# Altium project mod_duo_x.PrjPCB (part 2 of 3)

## Sheet [3]-ROTARY_ENCODER.SchDoc
size A3; SheetNumber: 4; SheetTotal: 8
Used 2 times, as channels U_[3]-ROTARY_ENCODER1, U_[3]-ROTARY_ENCODER2. Parts and nets are listed once, with the designators drawn on the sheet.
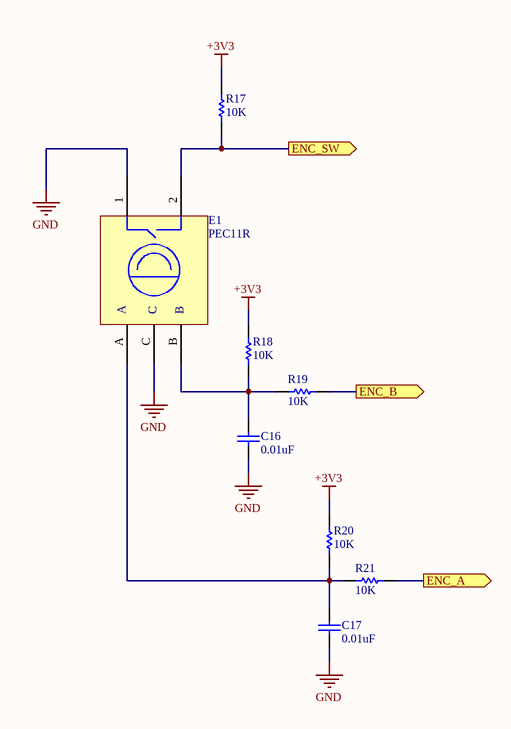
[diagram p3: [3]-ROTARY_ENCODER.SchDoc]

### Parts
C16  0.01uF  [CAPC1608N]
C17  0.01uF  [CAPC1608N]
E1  PEC11R  [PEC11R]
R17  10K  [RESC1608N]
R18  10K  [RESC1608N]
R19  10K  [RESC1608N]
R20  10K  [RESC1608N]
R21  10K  [RESC1608N]

### Ports
ENC_A (out), ENC_B (out), ENC_SW (out)

### Nets
+3V3: R17.2 R18.2 R20.2
GND: C16.1 C17.1 E1.1 E1.C
ENC_A: R21.1 ; port ENC_A
ENC_B: R19.1 ; port ENC_B
ENC_SW: E1.2 R17.1 ; port ENC_SW
NetC16_2: C16.2 E1.B R18.1 R19.2
NetC17_2: C17.2 E1.A R20.1 R21.2

### Channels
U_[3]-ROTARY_ENCODER1: designators end in A; ports ENC_A=ENC_A1 ENC_B=ENC_B1 ENC_SW=ENC_SW1
U_[3]-ROTARY_ENCODER2: designators end in B; ports ENC_A=ENC_A2 ENC_B=ENC_B2 ENC_SW=ENC_SW2

### Library data of the parts
C16 C17 = 06035C-103KAT2A: CAP CER 10000PF 50V X7R 0603; Manufacturer 1: Kyocera AVX; Dielectric Material: Ceramic; Tolerance: 10%; Capacitance: 10nF; Dissipation Factor: 2.5%; Insulation Resistance: 100GR; Supplier 1: Digi-Key; Manufacturer Part Number 1: 06035C-103KAT2A; Stock 1: 40000; Pricing 1: 1=0.1, 10=0.075, 100=0.0334, 500=0.02388, 1000=0.01877 (USD); Mount: Surface Mount,PCB; Case/Package: 0603; Number of Pins: 2; Case Code (Metric): 1608; Case Code (Imperial): 0603; Contact Plating: Tin,Matte; Min Operating Temperature: -55°C; Max Operating Temperature: 125°C; Dielectric: X7R; Voltage Rating (DC): 50V; Packaging: Tape and Reel; Voltage: 50V; Voltage Rating: 50V; Package Quantity: 1; Termination: SMD/SMT; Length: 1.6mm; Height: 0.9mm; Width: 0.032inch; Depth: 0.81mm; Thickness: 0.035inch; Radiation Hardening: No; REACH SVHC: No SVHC; Lead Free: Lead Free; ComponentLink1URL: https://datasheet.ciiva.com/1124/1679506-1124848.pdf; ComponentLink1Description: https://datasheet.ciiva.com/1124/1679506-1124848.pdf; ComponentLink2URL: https://datasheet.ciiva.com/2987/cx7r-2987824.pdf; ComponentLink2Description: https://datasheet.ciiva.com/2987/cx7r-2987824.pdf; ComponentLink3URL: https://datasheet.ciiva.com/150/cx7r-150227.pdf; ComponentLink3Description: https://datasheet.ciiva.com/150/cx7r-150227.pdf; ComponentLink4URL: https://datasheet.ciiva.com/150/cx7r-150228.pdf; ComponentLink4Description: https://datasheet.ciiva.com/150/cx7r-150228.pdf; ComponentLink5URL: https://datasheet.ciiva.com/150/cx7r-150229.pdf; ComponentLink5Description: https://datasheet.ciiva.com/150/cx7r-150229.pdf; ComponentLink6URL: https://datasheet.ciiva.com/16209/cx7r-16209238.pdf; ComponentLink6Description: https://datasheet.ciiva.com/16209/cx7r-16209238.pdf; ComponentLink7URL: https://datasheet.ciiva.com/15212/getdatasheetpartid-87506-15212295.pdf; ComponentLink7Description: https://datasheet.ciiva.com/15212/getdatasheetpartid-87506-15212295.pdf; ComponentLink8URL: https://datasheet.ciiva.com/5423/cx7r-218113-5423178.pdf; ComponentLink8Description: https://datasheet.ciiva.com/5423/cx7r-218113-5423178.pdf; ComponentLink9URL: https://datasheet.ciiva.com/7855/1679506-7855082.pdf; ComponentLink9Description: https://datasheet.ciiva.com/7855/1679506-7855082.pdf; ComponentLink10URL: https://datasheet.ciiva.com/14585/70001075-14585146.pdf; ComponentLink10Description: https://datasheet.ciiva.com/14585/70001075-14585146.pdf; ComponentLink11URL: https://datasheet.ciiva.com/25901/cx7r-25901100.pdf; ComponentLink11Description: https://datasheet.ciiva.com/25901/cx7r-25901100.pdf; ComponentLink12URL: https://datasheet.ciiva.com/1124/1679506-1124847.pdf; ComponentLink12Description: https://datasheet.ciiva.com/1124/1679506-1124847.pdf; ComponentLink13URL: https://datasheet.ciiva.com/2987/cx7r-2987823.pdf; ComponentLink13Description: https://datasheet.ciiva.com/2987/cx7r-2987823.pdf; Supplier Part Number 1: 478-1227-1-ND
E1 = PEC11R-4215F-S0024: ENCODER ROTARY 15MM SHAFT; Manufacturer 1: Bourns; Number of Channels: 2; Encoder Type: Mechanical; Pulses per Revolution: 24; Detent: Yes; Output Type: Quadrature,Incremental; Hole Diameter: 1.8mm; Supplier 1: Digi-Key; Manufacturer Part Number 1: PEC11R-4215F-S0024; Stock 1: 2746; Pricing 1: 1=1.68, 10=1.566, 25=1.4792, 50=1.305, 150=1.073, 300=1.044, 600=0.986, 1050=0.928, 5100=0.812 (USD); Mount: Through Hole,Panel,PCB; Min Operating Temperature: -30°C; Max Operating Temperature: 70°C; Package Quantity: 150; Packaging: Bulk; Termination: PC Pins; Orientation: Vertical; Built in Switch: Yes; Type: Mechanical; Length: 21.5mm; Height: 13.4mm; Width: 12.5mm; Radiation Hardening: No; REACH SVHC: No SVHC; ComponentLink1URL: https://datasheet.ciiva.com/26917/getdatasheetpartid-730131-26917851.pdf; ComponentLink1Description: https://datasheet.ciiva.com/26917/getdatasheetpartid-730131-26917851.pdf; ComponentLink2URL: https://datasheet.ciiva.com/12175/pec11r-221203-12175422.pdf; ComponentLink2Description: https://datasheet.ciiva.com/12175/pec11r-221203-12175422.pdf; Supplier Part Number 1: PEC11R-4215F-S0024-ND
R17-R21 = AC0603JR-0710KL: RES SMD 10K OHM 5% 1/10W 0603; Manufacturer 1: Yageo; Voltage Rating: 50V; Resistance: 10kR; Power Rating: 100mW; Temperature Coefficient: 100ppm/°C; Supplier 1: Digi-Key; Manufacturer Part Number 1: AC0603JR-0710KL; Stock 1: 60451; Pricing 1: 1=0.1, 10=0.032, 100=0.0131, 1000=0.00588, 2500=0.0051 (USD); Case/Package: 0603; Case Code (Imperial): 0603; Case Code (Metric): 1608; Min Operating Temperature: -55°C; Max Operating Temperature: 155°C; Packaging: Tape and Reel; Tolerance: 5%; Package Quantity: 1; Composition: Thick Film; Termination: SMD/SMT; Number of Terminations: 2; Military Standard: Not; Max Power Dissipation: 100mW; Features: Moisture Resistant,Automotive AEC-Q200,Anti-Sulfur; Length: 0.063inch; Height: 0.022inch; Width: 0.031inch; Depth: 0.8mm; Lead Free: Lead Free; ComponentLink1URL: https://datasheet.ciiva.com/5562/pyu-ac-51-rohs-l-2-5562553.pdf; ComponentLink1Description: https://datasheet.ciiva.com/5562/pyu-ac-51-rohs-l-2-5562553.pdf; Supplier Part Number 1: 311-10KLECT-ND

## Sheet [4]-DISPLAY_ERC12864FS.SchDoc
size A3; SheetNumber: 5; SheetTotal: 8
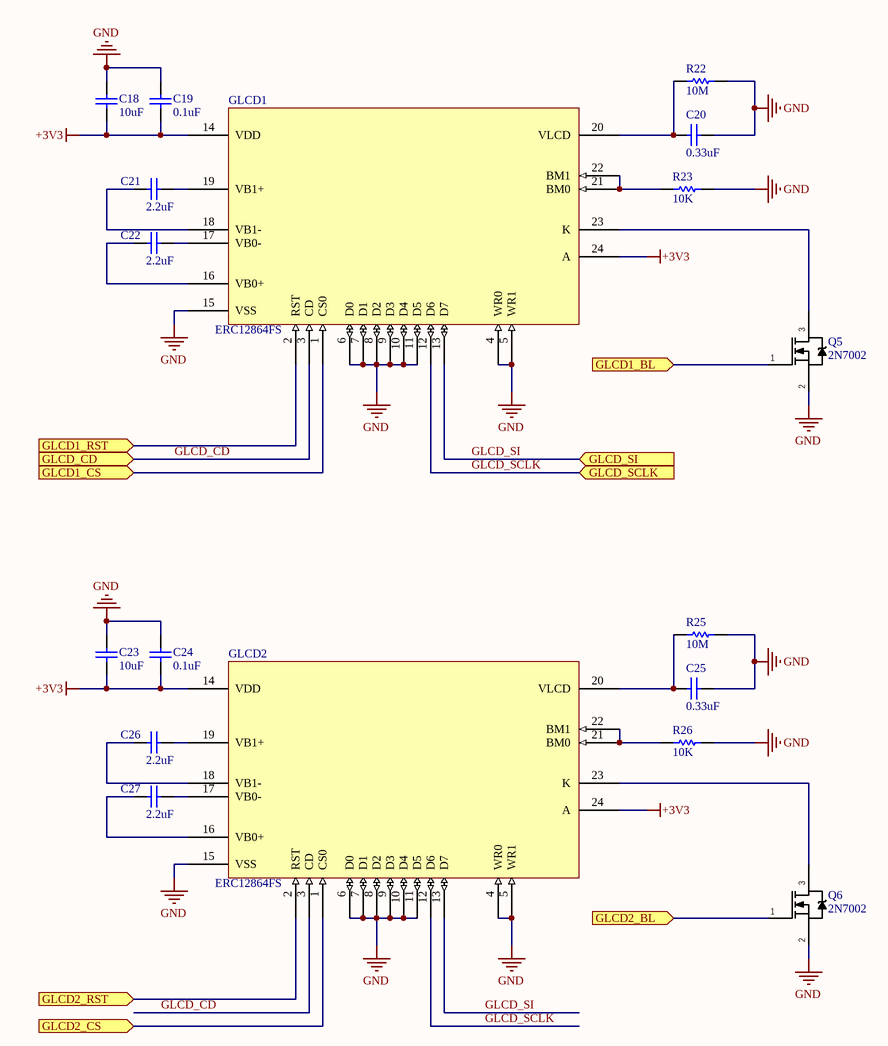
[diagram p4: [4]-DISPLAY_ERC12864FS.SchDoc]

### Parts
C18  10uF  [CAPC1608N]
C19  0.1uF  [CAPC1608N]
C20  0.33uF  [CAPC2012N]
C21  2.2uF  [CAPC2012N]
C22  2.2uF  [CAPC2012N]
C23  10uF  [CAPC1608N]
C24  0.1uF  [CAPC1608N]
C25  0.33uF  [CAPC2012N]
C26  2.2uF  [CAPC2012N]
C27  2.2uF  [CAPC2012N]
GLCD1  ERC12864FS  [ERC12864FS]
GLCD2  ERC12864FS  [ERC12864FS]
Q5  2N7002  [SOT23-3N]
Q6  2N7002  [SOT23-3N]
R22  10M  [RESC1608N]
R23  10K  [RESC1608N]
R25  10M  [RESC1608N]
R26  10K  [RESC1608N]

### Ports
GLCD1_BL (in), GLCD1_CS (in), GLCD1_RST (in), GLCD2_BL (in), GLCD2_CS (in), GLCD2_RST (in), GLCD_CD (in), GLCD_SCLK (in), GLCD_SI (in)

### Nets
+3V3: C18.1 C19.1 C23.1 C24.1 GLCD1.14(VDD) GLCD1.24(A) GLCD2.14(VDD) GLCD2.24(A)
GND: C18.2 C19.2 C20.2 C23.2 C24.2 C25.2 GLCD1.4(WR0) GLCD1.5(WR1) GLCD1.6(D0) GLCD1.7(D1) GLCD1.8(D2) GLCD1.9(D3) GLCD1.10(D4) GLCD1.11(D5) GLCD1.15(VSS) GLCD2.4(WR0) GLCD2.5(WR1) GLCD2.6(D0) GLCD2.7(D1) GLCD2.8(D2) GLCD2.9(D3) GLCD2.10(D4) GLCD2.11(D5) GLCD2.15(VSS) Q5.2(S) Q6.2(S) R22.2 R23.1 R25.2 R26.1
GLCD_CD: GLCD1.3(CD) GLCD2.3(CD) ; port GLCD_CD
GLCD_SCLK: GLCD1.12(D6) GLCD2.12(D6) ; port GLCD_SCLK
GLCD_SI: GLCD1.13(D7) GLCD2.13(D7) ; port GLCD_SI
NetC20_1: C20.1 GLCD1.20(VLCD) R22.1
NetC21_1: C21.1 GLCD1.18(VB1-)
NetC21_2: C21.2 GLCD1.19(VB1+)
NetC22_1: C22.1 GLCD1.16(VB0+)
NetC22_2: C22.2 GLCD1.17(VB0-)
NetC25_1: C25.1 GLCD2.20(VLCD) R25.1
NetC26_1: C26.1 GLCD2.18(VB1-)
NetC26_2: C26.2 GLCD2.19(VB1+)
NetC27_1: C27.1 GLCD2.16(VB0+)
NetC27_2: C27.2 GLCD2.17(VB0-)
NetGLCD1_1: GLCD1.1(CS0) ; port GLCD1_CS
NetGLCD1_2: GLCD1.2(RST) ; port GLCD1_RST
NetGLCD1_21: GLCD1.21(BM0) GLCD1.22(BM1) R23.2
NetGLCD1_23: GLCD1.23(K) Q5.3(D)
NetGLCD2_1: GLCD2.1(CS0) ; port GLCD2_CS
NetGLCD2_2: GLCD2.2(RST) ; port GLCD2_RST
NetGLCD2_21: GLCD2.21(BM0) GLCD2.22(BM1) R26.2
NetGLCD2_23: GLCD2.23(K) Q6.3(D)
NetQ5_1: Q5.1(G) ; port GLCD1_BL
NetQ6_1: Q6.1(G) ; port GLCD2_BL

### Library data of the parts
C18 C23 = GRM188R61A106KE69D: CAP CER 10UF 10V X5R 0603; Manufacturer 1: Murata; Tolerance: 10%; Supplier 1: Digi-Key; Manufacturer Part Number 1: GRM188R61A106KE69D; Stock 1: 40000; Pricing 1: 1=0.22, 10=0.149, 100=0.0754, 500=0.05158, 1000=0.04563 (USD); Mount: Surface Mount; Case/Package: 0603; Case Code (Metric): 1608; Case Code (Imperial): 0603; Min Operating Temperature: -55°C; Max Operating Temperature: 85°C; Capacitance: 10uF; Packaging: Tape and Reel; Dielectric: X5R; Voltage Rating: 10V; Voltage: 10V; Voltage Rating (DC): 10V; Length: 1.6mm; Height: 0.8mm; Width: 0.031inch; Thickness: 0.037inch; Depth: 0.8mm; REACH SVHC: No SVHC; Lead Free: Lead Free; Supplier Part Number 1: 490-10474-1-ND
C19 C24 = CC0603KRX7R8BB104: CAP CER 0.1UF 25V X7R 0603; Manufacturer 1: Yageo; Capacitance: 100nF; Tolerance: 10%; Supplier 1: Digi-Key; Manufacturer Part Number 1: CC0603KRX7R8BB104; Stock 1: 40000; Pricing 1: 1=0.1, 10=0.074, 100=0.0329, 500=0.02352, 1000=0.01848 (USD); Mount: Surface Mount; Case/Package: 0603; Number of Pins: 2; Case Code (Imperial): 0603; Case Code (Metric): 1608; Min Operating Temperature: -55°C; Max Operating Temperature: 125°C; Dielectric: X7R; Voltage Rating: 25V; Packaging: Tape and Reel; Package Quantity: 1; Voltage Rating (DC): 25V; Termination: SMD/SMT; Composition: Ceramic; Voltage: 25V; Length: 1.6mm; Height: 0.8mm; Width: 0.8mm; Thickness: 0.035inch; Depth: 0.8mm; Radiation Hardening: No; REACH SVHC: Unknown; Lead Free: Lead Free; Halogen Free: Halogen Free; ComponentLink1URL: https://datasheet.ciiva.com/11786/0900766b80c10176-11786120.pdf; ComponentLink1Description: https://datasheet.ciiva.com/11786/0900766b80c10176-11786120.pdf; ComponentLink2URL: https://datasheet.ciiva.com/144/mlccorderingcode-144075.pdf; ComponentLink2Description: https://datasheet.ciiva.com/144/mlccorderingcode-144075.pdf; ComponentLink3URL: https://datasheet.ciiva.com/17434/upy-gphc-x7r-6-3v-to-50v-8-17434263.pdf; ComponentLink3Description: https://datasheet.ciiva.com/17434/upy-gphc-x7r-6-3v-to-50v-8-17434263.pdf; ComponentLink4URL: https://datasheet.ciiva.com/26829/getdatasheetpartid-403577-26829431.pdf; ComponentLink4Description: https://datasheet.ciiva.com/26829/getdatasheetpartid-403577-26829431.pdf; ComponentLink5URL: https://datasheet.ciiva.com/11587/upy-gphc-x7r-6-3v-to-50v-8-11587208.pdf; ComponentLink5Description: https://datasheet.ciiva.com/11587/upy-gphc-x7r-6-3v-to-50v-8-11587208.pdf; ComponentLink6URL: https://datasheet.ciiva.com/13389/upy-gphc-x7r-6-3v-to-50v-8-13389352.pdf; ComponentLink6Description: https://datasheet.ciiva.com/13389/upy-gphc-x7r-6-3v-to-50v-8-13389352.pdf; ComponentLink7URL: https://datasheet.ciiva.com/28450/1489800-28450584.pdf; ComponentLink7Description: https://datasheet.ciiva.com/28450/1489800-28450584.pdf; ComponentLink8URL: https://datasheet.ciiva.com/144/mlccorderingcode-144073.pdf; ComponentLink8Description: https://datasheet.ciiva.com/144/mlccorderingcode-144073.pdf; ComponentLink9URL: https://datasheet.ciiva.com/144/mlccorderingcode-144074.pdf; ComponentLink9Description: https://datasheet.ciiva.com/144/mlccorderingcode-144074.pdf; ComponentLink10URL: https://datasheet.ciiva.com/7978/1489800-7978155.pdf; ComponentLink10Description: https://datasheet.ciiva.com/7978/1489800-7978155.pdf; Supplier Part Number 1: 311-1341-1-ND
C20 C25 = C0805C334K5RACAUTO: CAP CER 0.33UF 50V X7R 0805; Manufacturer 1: Kemet; Description 1: Multilayer Ceramic Capacitors MLCC - SMD/SMT 0.33uF 50volts 10% X7R; Capacitance - nF: 330 nF; Capacitance - pF: 330000 pF; Case Height: 0.9 mm; Case Length: 2 mm; Case Width: 1.2 mm; Class: Class 1; Tolerance: 10 %; Temperature Coefficient / Code: +/- 15 %; Type: SMD MLCC X7R 6.3 - 250 VDC Commerical Grade; Supplier 1: Digi-Key; Manufacturer Part Number 1: C0805C334K5RACAUTO; Stock 1: 76; Pricing 1: 1=0.21, 10=0.142, 100=0.0721, 500=0.0493, 1000=0.0436 (USD); Brand: Kemet; Capacitance: 0.33 uF; Case Code - in: 0805; Case Code - mm: 2012; Dimensions: 1.2 mm W x 2 mm L x 0.9 mm H; Dielectric: X7R; Factory Pack Quantity: 4000; Voltage Rating: 50 V; Product Category: Multilayer Ceramic Capacitors MLCC - SMD/SMT; RoHS: Details; Voltage Rating DC: 50 V; Minimum Operating Temperature: - 55 C; Maximum Operating Temperature: + 125 C; Product: Automotive MLCCs; Operating Temperature Range: - 55 C to + 125 C; Package / Case: 0805 (2012 metric); Packaging: Reel; Series: C0805C; Termination Style: SMD/SMT; ComponentLink1URL: https://datasheet.ciiva.com/7842/1776105-7842326.pdf; ComponentLink1Description: https://datasheet.ciiva.com/7842/1776105-7842326.pdf; ComponentLink2URL: https://datasheet.ciiva.com/22705/1776105-22705463.pdf; ComponentLink2Description: https://datasheet.ciiva.com/22705/1776105-22705463.pdf; Supplier Part Number 1: 399-6959-1-ND; Supplier 2: Digi-Key; Supplier Part Number 2: 1276-1808-1-ND; Manufacturer 2: Samsung; Manufacturer Part Number 2: CL21B334KAFNNNE
C21 C22 C26 C27 = C2012X7R1C225K125AB: CAP CER 2.2UF 16V X7R 0805; Manufacturer 1: TDK; Dielectric Material: Ceramic; Tolerance: 10%; Supplier 1: Digi-Key; Manufacturer Part Number 1: C2012X7R1C225K125AB; Stock 1: 20000; Pricing 1: 1=0.28, 10=0.194, 100=0.0983, 500=0.06728, 1000=0.05951 (USD); Mount: Surface Mount; Case/Package: 0805; Number of Pins: 2; Weight: 0.000194oz; Case Code (Imperial): 0805; Case Code (Metric): 2012; Min Operating Temperature: -55°C; Max Operating Temperature: 125°C; Capacitance: 2.2uF; Dielectric: X7R; Packaging: Tape and Reel; Package Quantity: 2000; Voltage Rating: 16V; Voltage Rating (DC): 16V; Termination: SMD/SMT; Voltage: 16V; Composition: Ceramic; Length: 2mm; Height: 1.25mm; Width: 1.25mm; Depth: 1.25mm; Thickness: 0.057inch; Radiation Hardening: No; REACH SVHC: No SVHC; Lead Free: Lead Free; ComponentLink1URL: https://datasheet.ciiva.com/24219/c2012x7r1c225k125ab-265065-24219730.pdf; ComponentLink1Description: https://datasheet.ciiva.com/24219/c2012x7r1c225k125ab-265065-24219730.pdf; ComponentLink2URL: https://datasheet.ciiva.com/11788/0900766b80c1bb00-11788135.pdf; ComponentLink2Description: https://datasheet.ciiva.com/11788/0900766b80c1bb00-11788135.pdf; ComponentLink3URL: https://datasheet.ciiva.com/26834/getdatasheetpartid-736487-26834421.pdf; ComponentLink3Description: https://datasheet.ciiva.com/26834/getdatasheetpartid-736487-26834421.pdf; ComponentLink4URL: https://datasheet.ciiva.com/16482/e412-c-16482422.pdf; ComponentLink4Description: https://datasheet.ciiva.com/16482/e412-c-16482422.pdf; ComponentLink5URL: https://datasheet.ciiva.com/6291/tdkmlcccaprange-6291383.pdf; ComponentLink5Description: https://datasheet.ciiva.com/6291/tdkmlcccaprange-6291383.pdf; ComponentLink6URL: https://datasheet.ciiva.com/6291/tdkmlcccaprange-6291384.pdf; ComponentLink6Description: https://datasheet.ciiva.com/6291/tdkmlcccaprange-6291384.pdf; ComponentLink7URL: https://datasheet.ciiva.com/22648/1796654-22648712.pdf; ComponentLink7Description: https://datasheet.ciiva.com/22648/1796654-22648712.pdf; ComponentLink8URL: https://datasheet.ciiva.com/6291/tdkmlcccaprange-6291450.pdf; ComponentLink8Description: https://datasheet.ciiva.com/6291/tdkmlcccaprange-6291450.pdf; ComponentLink9URL: https://datasheet.ciiva.com/22694/1796654-22694143.pdf; ComponentLink9Description: https://datasheet.ciiva.com/22694/1796654-22694143.pdf; Supplier Part Number 1: 445-1420-1-ND
GLCD1 GLCD2 = ERC12864FS-655: SERIAL SPI 2.8"GLCD 128x64 UC1701 CONTROLLER; Manufacturer 1: EastRising; Manufacturer Part Number 1: ERC12864FS-655; Supplier 1: EastRising; Supplier Part Number 1: ERC12864FS-655
Q5 Q6 = 2N7002: MOSFET N-CH 60V 115MA SOT-23; Manufacturer 1: ON Semiconductor / Fairchild; Max Power Dissipation: 200mW; Drain to Source Resistance: 1.2R; Gate to Source Voltage (Vgs): 20V; Nominal Vgs: 2.1V; Number of Elements: 1; Element Configuration: Single; Input Capacitance: 50pF; Rds On Max: 7.5R; On-State Resistance: 5.3R; Supplier 1: Digi-Key; Manufacturer Part Number 1: 2N7002; Stock 1: 111118; Pricing 1: 1=0.33, 10=0.304, 100=0.17, 500=0.09108, 1000=0.06193 (USD); Mount: Surface Mount; Case/Package: SOT-23; Number of Pins: 3; Contact Plating: Tin,Matte; Min Operating Temperature: -55°C; Max Operating Temperature: 150°C; Continuous Drain Current (ID): 115mA; Packaging: Tape and Reel; Package Quantity: 1; Drain to Source Voltage (Vdss): 60V; Drain to Source Breakdown Voltage: 60V; Power Dissipation: 200mW; Threshold Voltage: 2.1V; Voltage Rating (DC): 60V; Current Rating: 115mA; Dual Supply Voltage: 60V; Current: 115mA; Voltage: 60V; Length: 2.92mm; Height: 0.93mm; Width: 3.05mm; Radiation Hardening: No; REACH SVHC: No SVHC; Lead Free: Lead Free; ComponentLink1URL: https://datasheet.ciiva.com/931/2n7000-931777.pdf; ComponentLink1Description: https://datasheet.ciiva.com/931/2n7000-931777.pdf; ComponentLink2URL: https://datasheet.ciiva.com/27746/47-0120-27746881.pdf; ComponentLink2Description: https://datasheet.ciiva.com/27746/47-0120-27746881.pdf; ComponentLink3URL: https://datasheet.ciiva.com/1254/2n7002-1254451.pdf; ComponentLink3Description: https://datasheet.ciiva.com/1254/2n7002-1254451.pdf; ComponentLink4URL: https://datasheet.ciiva.com/15137/getdatasheetpartid-93547-15137771.pdf; ComponentLink4Description: https://datasheet.ciiva.com/15137/getdatasheetpartid-93547-15137771.pdf; ComponentLink5URL: https://datasheet.ciiva.com/931/2n7000-931762.pdf; ComponentLink5Description: https://datasheet.ciiva.com/931/2n7000-931762.pdf; ComponentLink6URL: https://datasheet.ciiva.com/931/2n7000-931763.pdf; ComponentLink6Description: https://datasheet.ciiva.com/931/2n7000-931763.pdf; ComponentLink7URL: https://datasheet.ciiva.com/931/2n7000-931764.pdf; ComponentLink7Description: https://datasheet.ciiva.com/931/2n7000-931764.pdf; ComponentLink8URL: https://datasheet.ciiva.com/1254/660093-1254452.pdf; ComponentLink8Description: https://datasheet.ciiva.com/1254/660093-1254452.pdf; ComponentLink9URL: https://datasheet.ciiva.com/1188/660093-1188359.pdf; ComponentLink9Description: https://datasheet.ciiva.com/1188/660093-1188359.pdf; ComponentLink10URL: https://datasheet.ciiva.com/1188/660093-1188361.pdf; ComponentLink10Description: https://datasheet.ciiva.com/1188/660093-1188361.pdf; ComponentLink11URL: https://datasheet.ciiva.com/17007/2n7002-17007243.pdf; ComponentLink11Description: https://datasheet.ciiva.com/17007/2n7002-17007243.pdf; ComponentLink12URL: https://datasheet.ciiva.com/3304/nds7002a-3304380.pdf; ComponentLink12Description: https://datasheet.ciiva.com/3304/nds7002a-3304380.pdf; ComponentLink13URL: https://datasheet.ciiva.com/3304/nds7002a-3304381.pdf; ComponentLink13Description: https://datasheet.ciiva.com/3304/nds7002a-3304381.pdf; ComponentLink14URL: https://datasheet.ciiva.com/22655/660093-22655230.pdf; ComponentLink14Description: https://datasheet.ciiva.com/22655/660093-22655230.pdf; Supplier Part Number 1: 2N7002NCT-ND
R22 R25 = CR0603-JW-106ELF: RES SMD 10M OHM 5% 1/10W 0603; Manufacturer 1: Bourns; Resistance: 10MR; Temperature Coefficient: 200ppm/°C; Power Rating: 100mW; Voltage Rating: 50V; Supplier 1: Digi-Key; Manufacturer Part Number 2: CR0603-JW-106ELF; Stock 1: 29967; Pricing 1: 1=0.1, 10=0.016, 100=0.0064, 1000=0.00289, 2500=0.0025 (USD); Mount: Surface Mount; Case/Package: 0603; Contact Plating: Tin; Case Code (Imperial): 0603; Case Code (Metric): 1608; Min Operating Temperature: -55°C; Max Operating Temperature: 155°C; Tolerance: 5%; Composition: Thick Film; Packaging: Tape and Reel; Package Quantity: 5000; Termination: SMD/SMT; Number of Terminations: 2; Max Power Dissipation: 100mW; Military Standard: Not; Length: 1.6mm; Height: 0.022inch; Width: 0.8mm; Thickness: 457um; Depth: 0.8mm; Radiation Hardening: No; ComponentLink1URL: https://datasheet.ciiva.com/9122/chpreztr-9122300.pdf; ComponentLink1Description: https://datasheet.ciiva.com/9122/chpreztr-9122300.pdf; ComponentLink2URL: https://datasheet.ciiva.com/18605/chpreztr-18605117.pdf; ComponentLink2Description: https://datasheet.ciiva.com/18605/chpreztr-18605117.pdf; ComponentLink3URL: https://datasheet.ciiva.com/18605/chpreztr-18605118.pdf; ComponentLink3Description: https://datasheet.ciiva.com/18605/chpreztr-18605118.pdf; ComponentLink4URL: https://datasheet.ciiva.com/18605/chpreztr-18605119.pdf; ComponentLink4Description: https://datasheet.ciiva.com/18605/chpreztr-18605119.pdf; Supplier Part Number 1: CR0603-JW-106ELFCT-ND
R23 R26 = AC0603JR-0710KL: as R17 on sheet [3]-ROTARY_ENCODER; Supplier 1: Digi-Key; Manufacturer Part Number 1: AC0603JR-0710KL; Stock 1: 60451; Pricing 1: 1=0.1, 10=0.032, 100=0.0131, 1000=0.00588, 2500=0.0051 (USD); Case/Package: 0603; Case Code (Imperial): 0603; Case Code (Metric): 1608; Min Operating Temperature: -55°C; Max Operating Temperature: 155°C; Packaging: Tape and Reel; Tolerance: 5%; Package Quantity: 1; Composition: Thick Film; Termination: SMD/SMT; Number of Terminations: 2; Military Standard: Not; Max Power Dissipation: 100mW; Features: Moisture Resistant,Automotive AEC-Q200,Anti-Sulfur; Length: 0.063inch; Height: 0.022inch; Width: 0.031inch; Depth: 0.8mm; Lead Free: Lead Free; ComponentLink1URL: https://datasheet.ciiva.com/5562/pyu-ac-51-rohs-l-2-5562553.pdf; ComponentLink1Description: https://datasheet.ciiva.com/5562/pyu-ac-51-rohs-l-2-5562553.pdf; Supplier Part Number 1: 311-10KLECT-ND

## Sheet [5]-PEAKMETER_LEDS.SchDoc
size A3; SheetNumber: 6; SheetTotal: 8
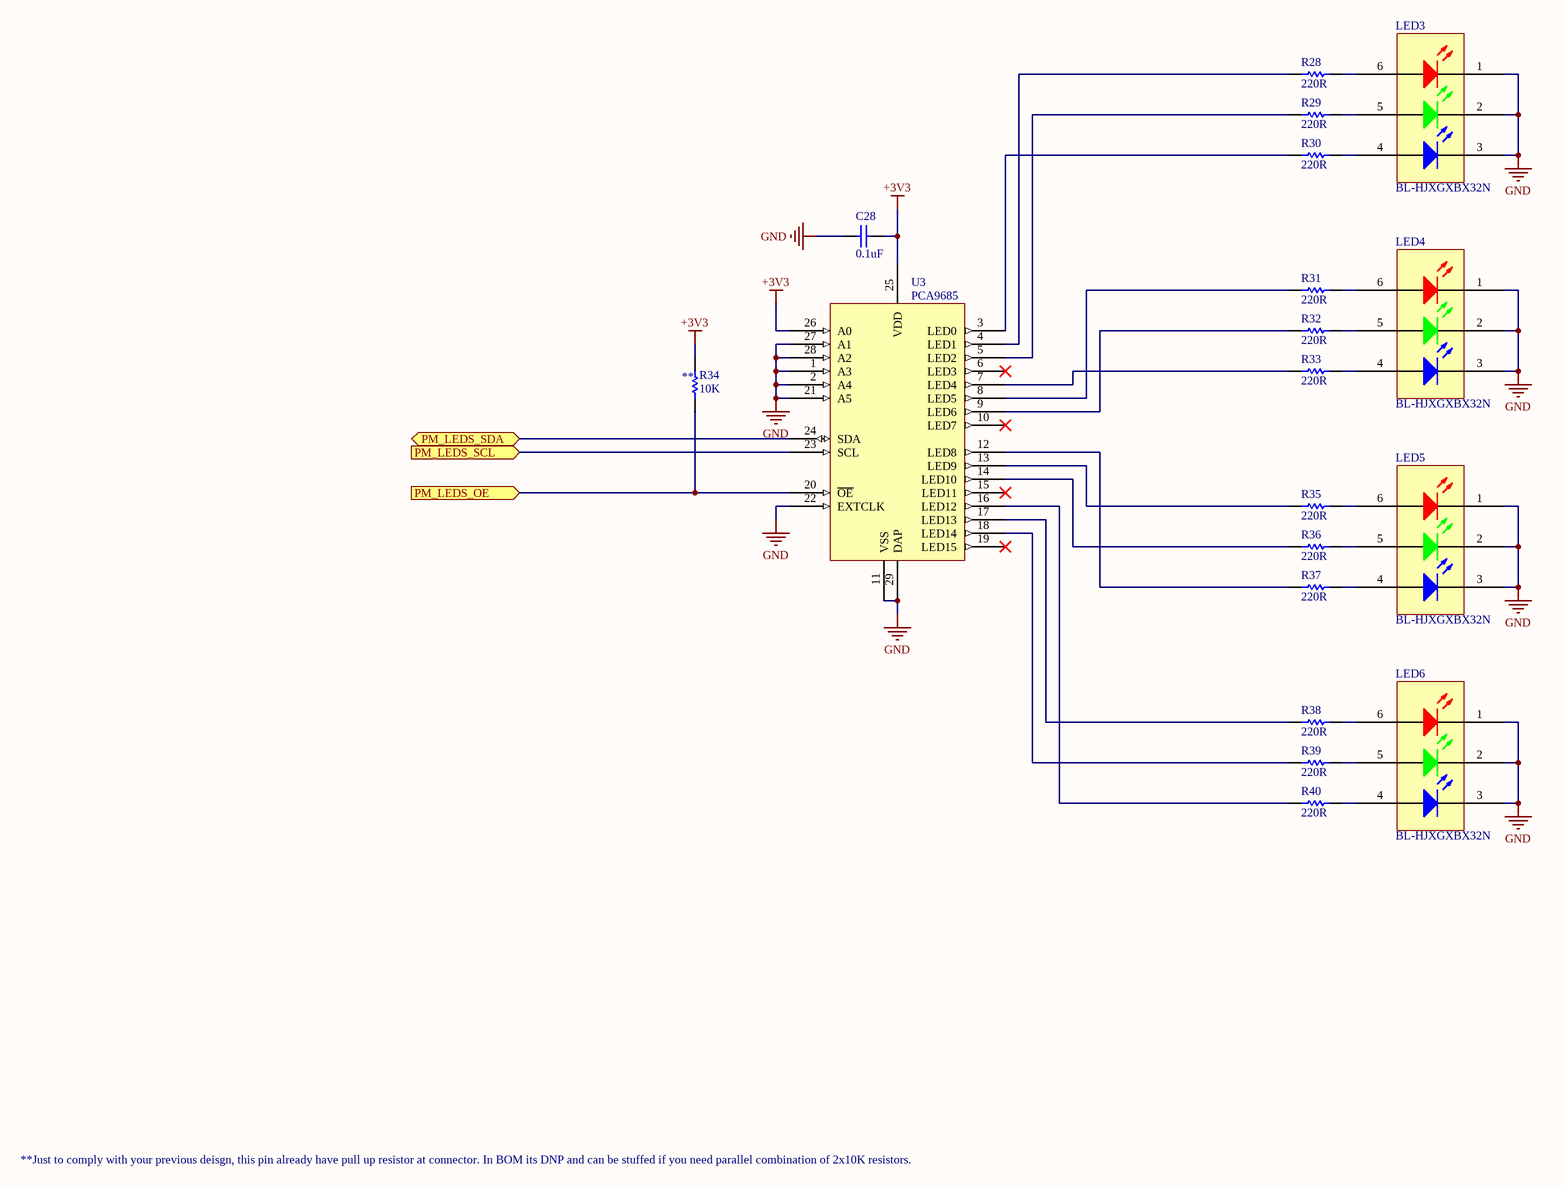
[diagram p5: [5]-PEAKMETER_LEDS.SchDoc]

### Parts
C28  0.1uF  [CAPC1608N]
LED3  BL-HJXGXBX32N  [BL-HJXGXBX32N]
LED4  BL-HJXGXBX32N  [BL-HJXGXBX32N]
LED5  BL-HJXGXBX32N  [BL-HJXGXBX32N]
LED6  BL-HJXGXBX32N  [BL-HJXGXBX32N]
R28  220R  [RESC1608N]
R29  220R  [RESC1608N]
R30  220R  [RESC1608N]
R31  220R  [RESC1608N]
R32  220R  [RESC1608N]
R33  220R  [RESC1608N]
R34  10K  [RESC1608N]
R35  220R  [RESC1608N]
R36  220R  [RESC1608N]
R37  220R  [RESC1608N]
R38  220R  [RESC1608N]
R39  220R  [RESC1608N]
R40  220R  [RESC1608N]
U3  PCA9685  [SOT788-1]

### Ports
PM_LEDS_OE (in), PM_LEDS_SCL (in), PM_LEDS_SDA (bidir)

### Nets
+3V3: C28.1 R34.1 U3.25(VDD) U3.26(A0)
GND: C28.2 LED3.1 LED3.2 LED3.3 LED4.1 LED4.2 LED4.3 LED5.1 LED5.2 LED5.3 LED6.1 LED6.2 LED6.3 U3.1(A3) U3.2(A4) U3.11(VSS) U3.21(A5) U3.22(EXTCLK) U3.27(A1) U3.28(A2) U3.29(DAP)
PM_LEDS_OE: R34.2 U3.20(~{OE}) ; port PM_LEDS_OE
PM_LEDS_SCL: U3.23(SCL) ; port PM_LEDS_SCL
PM_LEDS_SDA: U3.24(SDA) ; port PM_LEDS_SDA
NetLED3_4: LED3.4 R30.2
NetLED3_5: LED3.5 R29.2
NetLED3_6: LED3.6 R28.2
NetLED4_4: LED4.4 R33.2
NetLED4_5: LED4.5 R32.2
NetLED4_6: LED4.6 R31.2
NetLED5_4: LED5.4 R37.2
NetLED5_5: LED5.5 R36.2
NetLED5_6: LED5.6 R35.2
NetLED6_4: LED6.4 R40.2
NetLED6_5: LED6.5 R39.2
NetLED6_6: LED6.6 R38.2
NetR28_1: R28.1 U3.4(LED1)
NetR29_1: R29.1 U3.5(LED2)
NetR30_1: R30.1 U3.3(LED0)
NetR31_1: R31.1 U3.8(LED5)
NetR32_1: R32.1 U3.9(LED6)
NetR33_1: R33.1 U3.7(LED4)
NetR35_1: R35.1 U3.13(LED9)
NetR36_1: R36.1 U3.14(LED10)
NetR37_1: R37.1 U3.12(LED8)
NetR38_1: R38.1 U3.17(LED13)
NetR39_1: R39.1 U3.18(LED14)
NetR40_1: R40.1 U3.16(LED12)

Not connected (* = marked no-connect by the designer): U3 6(LED3)* 10(LED7)* 15(LED11)* 19(LED15)*

### Notes on the sheet
- (near R34) **
- **Just to comply with your previous deisgn, this pin already have pull up resistor at connector. In BOM its DNP and can be stuffed if you need parallel combination of 2x10K resistors.

### Library data of the parts
C28 = CC0603KRX7R8BB104: as C19 on sheet [4]-DISPLAY_ERC12864FS; Supplier 1: Digi-Key; Manufacturer Part Number 1: CC0603KRX7R8BB104; Stock 1: 40000; Pricing 1: 1=0.1, 10=0.074, 100=0.0329, 500=0.02352, 1000=0.01848 (USD); Mount: Surface Mount; Case/Package: 0603; Number of Pins: 2; Case Code (Imperial): 0603; Case Code (Metric): 1608; Min Operating Temperature: -55°C; Max Operating Temperature: 125°C; Dielectric: X7R; Voltage Rating: 25V; Packaging: Tape and Reel; Package Quantity: 1; Voltage Rating (DC): 25V; Termination: SMD/SMT; Composition: Ceramic; Voltage: 25V; Length: 1.6mm; Height: 0.8mm; Width: 0.8mm; Thickness: 0.035inch; Depth: 0.8mm; Radiation Hardening: No; REACH SVHC: Unknown; Lead Free: Lead Free; Halogen Free: Halogen Free; ComponentLink1URL: https://datasheet.ciiva.com/11786/0900766b80c10176-11786120.pdf; ComponentLink1Description: https://datasheet.ciiva.com/11786/0900766b80c10176-11786120.pdf; ComponentLink2URL: https://datasheet.ciiva.com/144/mlccorderingcode-144075.pdf; ComponentLink2Description: https://datasheet.ciiva.com/144/mlccorderingcode-144075.pdf; ComponentLink3URL: https://datasheet.ciiva.com/17434/upy-gphc-x7r-6-3v-to-50v-8-17434263.pdf; ComponentLink3Description: https://datasheet.ciiva.com/17434/upy-gphc-x7r-6-3v-to-50v-8-17434263.pdf; ComponentLink4URL: https://datasheet.ciiva.com/26829/getdatasheetpartid-403577-26829431.pdf; ComponentLink4Description: https://datasheet.ciiva.com/26829/getdatasheetpartid-403577-26829431.pdf; ComponentLink5URL: https://datasheet.ciiva.com/11587/upy-gphc-x7r-6-3v-to-50v-8-11587208.pdf; ComponentLink5Description: https://datasheet.ciiva.com/11587/upy-gphc-x7r-6-3v-to-50v-8-11587208.pdf; ComponentLink6URL: https://datasheet.ciiva.com/13389/upy-gphc-x7r-6-3v-to-50v-8-13389352.pdf; ComponentLink6Description: https://datasheet.ciiva.com/13389/upy-gphc-x7r-6-3v-to-50v-8-13389352.pdf; ComponentLink7URL: https://datasheet.ciiva.com/28450/1489800-28450584.pdf; ComponentLink7Description: https://datasheet.ciiva.com/28450/1489800-28450584.pdf; ComponentLink8URL: https://datasheet.ciiva.com/144/mlccorderingcode-144073.pdf; ComponentLink8Description: https://datasheet.ciiva.com/144/mlccorderingcode-144073.pdf; ComponentLink9URL: https://datasheet.ciiva.com/144/mlccorderingcode-144074.pdf; ComponentLink9Description: https://datasheet.ciiva.com/144/mlccorderingcode-144074.pdf; ComponentLink10URL: https://datasheet.ciiva.com/7978/1489800-7978155.pdf; ComponentLink10Description: https://datasheet.ciiva.com/7978/1489800-7978155.pdf; Supplier Part Number 1: 311-1341-1-ND
LED3-LED6 = BL-HJXGXBX32N: LED RGB 6PLCC SMD; Manufacturer 1: American Bright; Supplier 1: Digi-Key; Manufacturer Part Number 1: BL-HJXGXBX32N; Stock 1: 23855; Pricing 1: 1=0.59000, 10=0.42700, 100=0.27880, 500=0.20040, 1000=0.15683 (USD); RoHS: No; Packaging: Cut Tape; Supplier Part Number 1: BL-HJXGXBX32NCT-ND
R28-R33 R35-R40 = CRCW0603220RJNEA: RES SMD 220 OHM 5% 1/10W 0603; Manufacturer 1: Vishay; Power Rating: 100mW; Temperature Coefficient: 200ppm/°C; Voltage Rating: 75V; Supplier 1: Digi-Key; Manufacturer Part Number 1: CRCW0603220RJNEA; Stock 1: 284000; Pricing 1: 1=0.1, 10=0.031, 100=0.0125, 1000=0.00563, 2500=0.00488 (USD); Mount: Surface Mount; Case/Package: 0603; Weight: 7.1E-05oz; Case Code (Metric): 1608; Case Code (Imperial): 0603; Contact Plating: Tin; Min Operating Temperature: -55°C; Max Operating Temperature: 155°C; Resistance: 220R; Tolerance: 5%; Packaging: Tape and Reel; Composition: Thick Film; Package Quantity: 1; Number of Terminations: 2; Max Power Dissipation: 100mW; Military Standard: Not; Termination: SMD/SMT; Features: Automotive AEC-Q200; Working Voltage: 75V; Length: 1.55mm; Height: 0.45mm; Width: 0.033inch; Depth: 0.85mm; Radiation Hardening: No; REACH SVHC: Unknown; ComponentLink1URL: https://datasheet.ciiva.com/2524/dcrcwe3-2524384.pdf; ComponentLink1Description: https://datasheet.ciiva.com/2524/dcrcwe3-2524384.pdf; ComponentLink2URL: https://datasheet.ciiva.com/2524/dcrcwe3-2524385.pdf; ComponentLink2Description: https://datasheet.ciiva.com/2524/dcrcwe3-2524385.pdf; ComponentLink3URL: https://datasheet.ciiva.com/2524/dcrcwe3-2524386.pdf; ComponentLink3Description: https://datasheet.ciiva.com/2524/dcrcwe3-2524386.pdf; ComponentLink4URL: https://datasheet.ciiva.com/8339/dcrcwe3-8339958.pdf; ComponentLink4Description: https://datasheet.ciiva.com/8339/dcrcwe3-8339958.pdf; ComponentLink5URL: https://datasheet.ciiva.com/22869/70201119-22869142.pdf; ComponentLink5Description: https://datasheet.ciiva.com/22869/70201119-22869142.pdf; ComponentLink6URL: https://datasheet.ciiva.com/46448/1807946-46448601.pdf; ComponentLink6Description: https://datasheet.ciiva.com/46448/1807946-46448601.pdf; ComponentLink7URL: https://datasheet.ciiva.com/5550/dcrcwe3-109170-5550730.pdf; ComponentLink7Description: https://datasheet.ciiva.com/5550/dcrcwe3-109170-5550730.pdf; Supplier Part Number 1: 541-220GCT-ND
R34 = AC0603JR-0710KL: as R17 on sheet [3]-ROTARY_ENCODER; Supplier 1: Digi-Key; Manufacturer Part Number 1: AC0603JR-0710KL; Stock 1: 60451; Pricing 1: 1=0.1, 10=0.032, 100=0.0131, 1000=0.00588, 2500=0.0051 (USD); Case/Package: 0603; Case Code (Imperial): 0603; Case Code (Metric): 1608; Min Operating Temperature: -55°C; Max Operating Temperature: 155°C; Packaging: Tape and Reel; Tolerance: 5%; Package Quantity: 1; Composition: Thick Film; Termination: SMD/SMT; Number of Terminations: 2; Military Standard: Not; Max Power Dissipation: 100mW; Features: Moisture Resistant,Automotive AEC-Q200,Anti-Sulfur; Length: 0.063inch; Height: 0.022inch; Width: 0.031inch; Depth: 0.8mm; Lead Free: Lead Free; ComponentLink1URL: https://datasheet.ciiva.com/5562/pyu-ac-51-rohs-l-2-5562553.pdf; ComponentLink1Description: https://datasheet.ciiva.com/5562/pyu-ac-51-rohs-l-2-5562553.pdf; Supplier Part Number 1: 311-10KLECT-ND
U3 = IC_PCA9685BS,118: IC LED DRVR LIN DIM 25MA 28HVQFN; Manufacturer 1: NXP Semiconductors; Number of Outputs: 16; Frequency: 50MHz; Output Voltage: 5.5V; Supplier 1: Digi-Key; Manufacturer Part Number 1: PCA9685BS,118; Stock 1: 4307; Pricing 1: 1=2.46, 10=2.205, 100=1.7727, 500=1.45642, 1000=1.20675 (USD); Mount: Surface Mount; Case/Package: VQFN; Number of Pins: 28; Contact Plating: Gold; Min Operating Temperature: -40°C; Max Operating Temperature: 85°C; Packaging: Tape and Reel; Package Quantity: 1; Radiation Hardening: No; ComponentLink1URL: https://datasheet.ciiva.com/12278/pca9685-62190-12278354.pdf; ComponentLink1Description: https://datasheet.ciiva.com/12278/pca9685-62190-12278354.pdf; ComponentLink2URL: https://datasheet.ciiva.com/8125/pca9685-8125351.pdf; ComponentLink2Description: https://datasheet.ciiva.com/8125/pca9685-8125351.pdf; ComponentLink3URL: https://datasheet.ciiva.com/1945/pca9685-1945099.pdf; ComponentLink3Description: https://datasheet.ciiva.com/1945/pca9685-1945099.pdf; ComponentLink4URL: https://datasheet.ciiva.com/1945/pca9685-1945100.pdf; ComponentLink4Description: https://datasheet.ciiva.com/1945/pca9685-1945100.pdf; ComponentLink5URL: https://datasheet.ciiva.com/1945/pca9685-1945101.pdf; ComponentLink5Description: https://datasheet.ciiva.com/1945/pca9685-1945101.pdf; Supplier Part Number 1: 568-5305-1-ND

## Sheet [6]-POTENTIOMETERS.SchDoc
size A3; SheetNumber: 7; SheetTotal: 8
Used 8 times, as channels U_[6]-POTENTIOMETERS1, U_[6]-POTENTIOMETERS2, U_[6]-POTENTIOMETERS3, U_[6]-POTENTIOMETERS4, U_[6]-POTENTIOMETERS5, U_[6]-POTENTIOMETERS6, U_[6]-POTENTIOMETERS7, U_[6]-POTENTIOMETERS8. Parts and nets are listed once, with the designators drawn on the sheet.
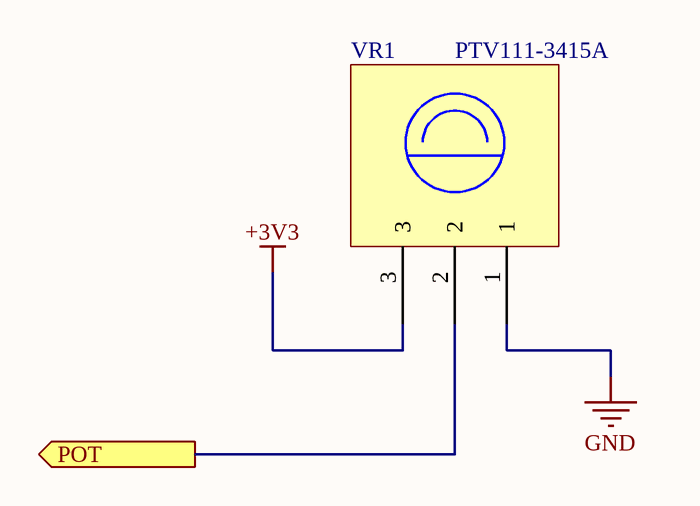
[diagram p6: [6]-POTENTIOMETERS.SchDoc]

### Parts
VR1  PTV111-3415A  [PTV111-3]

### Ports
POT (out)

### Nets
+3V3: VR1.3
GND: VR1.1
POT: VR1.2 ; port POT

### Channels
U_[6]-POTENTIOMETERS1: designators end in A; ports POT=POT1
U_[6]-POTENTIOMETERS2: designators end in B; ports POT=POT2
U_[6]-POTENTIOMETERS3: designators end in C; ports POT=POT3
U_[6]-POTENTIOMETERS4: designators end in D; ports POT=POT4
U_[6]-POTENTIOMETERS5: designators end in E; ports POT=POT5
U_[6]-POTENTIOMETERS6: designators end in F; ports POT=POT6
U_[6]-POTENTIOMETERS7: designators end in G; ports POT=POT7
U_[6]-POTENTIOMETERS8: designators end in H; ports POT=POT8

### Library data of the parts
VR1 = PTV111-3415A-B103: POT 10K OHM 1/20W CARBON LINEAR; Manufacturer 1: Bourns; Resistance: 10kR; Tolerance: 20%; Power Rating: 50mW; Number of Turns: 1; Voltage Rating (DC): 20V; Actuator Length: 0.591inch; Actuator Diameter: 0.236inch; Hole Diameter: 9mm; Supplier 1: Digi-Key; Manufacturer Part Number 1: PTV111-3415A-B103; Stock 1: 227; Pricing 1: 1=1.36, 10=1.2, 25=1.08, 50=1.04, 100=1, 300=0.94, 500=0.8, 1000=0.74, 5000=0.608 (USD); Mount: Through Hole,Panel,Brackets; Min Operating Temperature: -10°C; Max Operating Temperature: 50°C; Composition: Potentiometer,Carbon; Type: Potentiometer; Packaging: Bulk; Package Quantity: 100; Taper: Linear; Termination: Pin; Number of Gangs: 1; Military Standard: Not; Max Power Dissipation: 50mW; Length: 12mm; Height: 7.5mm; Radiation Hardening: No; REACH SVHC: No SVHC; ComponentLink1URL: https://datasheet.ciiva.com/11831/0900766b80fa58ed-11831312.pdf; ComponentLink1Description: https://datasheet.ciiva.com/11831/0900766b80fa58ed-11831312.pdf; ComponentLink2URL: https://datasheet.ciiva.com/6249/ptvptt-6249367.pdf; ComponentLink2Description: https://datasheet.ciiva.com/6249/ptvptt-6249367.pdf; Supplier Part Number 1: PTV111-3415A-B103-ND

## Sheet [7]-POWER_DCDC_3V3.SchDoc
size A3; SheetNumber: 8; SheetTotal: 8
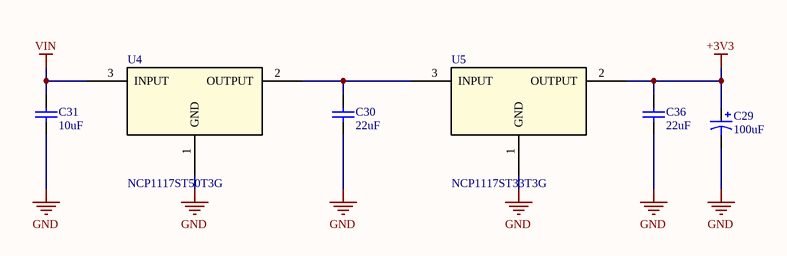
[diagram p7: [7]-POWER_DCDC_3V3.SchDoc]

### Parts
C29  100uF  [CAPAE6553X55M]
C30  22uF  [CAPC2012N]
C31  10uF  [CAPC2012N]
C36  22uF  [CAPC2012N]
U4  NCP1117ST50T3G  [SOT230P700X180-4N]
U5  NCP1117ST33T3G  [SOT230P700X180-4N]

### Nets
+3V3: C29.1 C36.2 U5.2(OUTPUT)
GND: C29.2 C30.1 C31.1 C36.1 U4.1(GND) U5.1(GND)
VIN: C31.2 U4.3(INPUT)
NetC30_2: C30.2 U4.2(OUTPUT) U5.3(INPUT)

### Library data of the parts
C29 = EEE-1AA101WR: CAP ALUM 100UF 20% 10V SMD; Manufacturer 1: Panasonic ECG; Description 1: Cap Aluminum Lytic 100uF 10V 20% (5 X 5.4mm) SMD 50mA 1000h 85C Automotive T/R; Ripple Current: 50mA; Life (Hours): 1000Hour; Supplier 1: Digi-Key; Manufacturer Part Number 1: EEE-1AA101WR; Stock 1: 122621; Pricing 1: 1=0.31, 10=0.212, 100=0.1272, 500=0.0954 (USD); Mount: Surface Mount,PCB; Case/Package: Radial; Contact Plating: Tin; Min Operating Temperature: -40°C; Max Operating Temperature: 85°C; Capacitance: 100uF; Tolerance: 20%; Voltage Rating: 10V; Packaging: Tape and Reel; Package Quantity: 1; Voltage Rating (DC): 10V; Termination: SMD/SMT; Ripple Current (AC): 50mA; Diameter: 5mm; Length: 5.5mm; Height: 5.4mm; Height - Seated (Max): 0.213inch; Radiation Hardening: No; Lead Free: Lead Free; REACH SVHC: Unknown; ComponentLink1URL: https://datasheet.ciiva.com/26945/getdatasheetpartid-169213-26945071.pdf; ComponentLink1Description: https://datasheet.ciiva.com/26945/getdatasheetpartid-169213-26945071.pdf; ComponentLink2URL: https://datasheet.ciiva.com/2983/aba0000ce2-2983906.pdf; ComponentLink2Description: https://datasheet.ciiva.com/2983/aba0000ce2-2983906.pdf; ComponentLink3URL: https://datasheet.ciiva.com/24027/aba0000ce2-40801-24027541.pdf; ComponentLink3Description: https://datasheet.ciiva.com/24027/aba0000ce2-40801-24027541.pdf; ComponentLink4URL: https://datasheet.ciiva.com/30075/11aba0000ce2-30075303.pdf; ComponentLink4Description: https://datasheet.ciiva.com/30075/11aba0000ce2-30075303.pdf; ComponentLink5URL: https://datasheet.ciiva.com/16427/aba0000ce2-16427544.pdf; ComponentLink5Description: https://datasheet.ciiva.com/16427/aba0000ce2-16427544.pdf; ComponentLink6URL: https://datasheet.ciiva.com/14598/70255710-14598233.pdf; ComponentLink6Description: https://datasheet.ciiva.com/14598/70255710-14598233.pdf; ComponentLink7URL: https://datasheet.ciiva.com/14605/70255710-14605689.pdf; ComponentLink7Description: https://datasheet.ciiva.com/14605/70255710-14605689.pdf; ComponentLink8URL: https://datasheet.ciiva.com/11673/aba0000ce2-11673882.pdf; ComponentLink8Description: https://datasheet.ciiva.com/11673/aba0000ce2-11673882.pdf; Supplier Part Number 1: PCE3867CT-ND
C30 C36 = JMK212BJ226MG-T: CAP CER 22UF 6.3V X5R 0805; Manufacturer 1: Taiyo Yuden; PCN Part Number: X5R, X7R Dielectrics 23/Jan/2008; Catalog Drawings: xMK Series_0805_1.25; Capacitance: 22µF; Tolerance: ±20%; Online Catalog: M Series; Kits: 587-1797-KIT-ND  - KIT CAP CER HI CAP 0603 & 0805 S; Other Names: 587-1305-1; Supplier 1: Digi-Key; Manufacturer Part Number 1: JMK212BJ226MG-T; Description 1: CAP CER 22UF 6.3V X5R 0805; Stock 1: 877962; Pricing 1: 1=0.26, 10=0.18, 100=0.1021, 500=0.0721, 1000=0.0631 (USD); Standard Package: 1; Category: Capacitors; Family: Ceramic Capacitors; Series: M; Packaging: Cut Tape (CT); Voltage - Rated: 6.3V; Temperature Coefficient: X5R; Mounting Type: Surface Mount, MLCC; Operating Temperature: -55°C ~ 85°C; Applications: General Purpose; Ratings: -; Package / Case: 0805 (2012 Metric); Size / Dimension: 0.079" L x 0.049" W (2.00mm x 1.25mm); Height - Seated (Max): -; Thickness (Max): 0.053" (1.35mm); Lead Spacing: -; Features: -; Lead Style: -; ComponentLink1URL: https://datasheet.ciiva.com/26872/getdatasheetpartid-637391-26872056.pdf; ComponentLink1Description: https://datasheet.ciiva.com/26872/getdatasheetpartid-637391-26872056.pdf; ComponentLink2URL: https://datasheet.ciiva.com/15921/279jmk212abj226mg-t-15921060.pdf; ComponentLink2Description: https://datasheet.ciiva.com/15921/279jmk212abj226mg-t-15921060.pdf; ComponentLink3URL: https://datasheet.ciiva.com/30094/218jmk212abj226mg-t-30094177.pdf; ComponentLink3Description: https://datasheet.ciiva.com/30094/218jmk212abj226mg-t-30094177.pdf; ComponentLink4URL: https://datasheet.ciiva.com/5424/mlcc-all-e-541559-5424395.pdf; ComponentLink4Description: https://datasheet.ciiva.com/5424/mlcc-all-e-541559-5424395.pdf; ComponentLink5URL: https://datasheet.ciiva.com/137/mlcc-all-e-137394.pdf; ComponentLink5Description: https://datasheet.ciiva.com/137/mlcc-all-e-137394.pdf; ComponentLink6URL: https://datasheet.ciiva.com/137/mlcc-all-e-137395.pdf; ComponentLink6Description: https://datasheet.ciiva.com/137/mlcc-all-e-137395.pdf; ComponentLink7URL: https://datasheet.ciiva.com/137/mlcc-all-e-137396.pdf; ComponentLink7Description: https://datasheet.ciiva.com/137/mlcc-all-e-137396.pdf; Supplier Part Number 1: 587-1305-1-ND
C31 = GRM21BR61E106KA73L: CAP CER 10UF 25V X5R 0805; Manufacturer 1: Murata; Product Training Modules: High-Cap Multilayer Ceramic Capacitors; Catalog Drawings: GRM Series_0805_1.25; Capacitance: 10µF; Tolerance: ±10%; Online Catalog: GRM Series; Other Names: 490-5523-6; Supplier 1: Digi-Key; Manufacturer Part Number 1: GRM21BR61E106KA73L; Description 1: CAP CER 10UF 25V X5R 0805; Stock 1: 1948894; Pricing 1: 1=0.22, 10=0.159, 100=0.0748, 500=0.0524, 1000=0.0434 (USD); Standard Package: 1; Category: Capacitors; Family: Ceramic Capacitors; Series: GRM; Packaging: Digi-Reel®; Voltage - Rated: 25V; Temperature Coefficient: X5R; Mounting Type: Surface Mount, MLCC; Operating Temperature: -55°C ~ 85°C; Applications: General Purpose; Ratings: -; Package / Case: 0805 (2012 Metric); Size / Dimension: 0.079" L x 0.049" W (2.00mm x 1.25mm); Height - Seated (Max): -; Thickness (Max): 0.053" (1.35mm); Lead Spacing: -; Features: -; Lead Style: -; ComponentLink1URL: https://datasheet.ciiva.com/16440/grm21br61e106ka73l-16440627.pdf; ComponentLink1Description: https://datasheet.ciiva.com/16440/grm21br61e106ka73l-16440627.pdf; ComponentLink2URL: https://datasheet.ciiva.com/5424/product-5424327.pdf; ComponentLink2Description: https://datasheet.ciiva.com/5424/product-5424327.pdf; ComponentLink3URL: https://datasheet.ciiva.com/22774/1747469-22774396.pdf; ComponentLink3Description: https://datasheet.ciiva.com/22774/1747469-22774396.pdf; ComponentLink4URL: https://datasheet.ciiva.com/28584/626718-28584288.pdf; ComponentLink4Description: https://datasheet.ciiva.com/28584/626718-28584288.pdf; ComponentLink5URL: https://datasheet.ciiva.com/29199/454623-da-01-en-vs-kondensator-0805-29199615.pdf; ComponentLink5Description: https://datasheet.ciiva.com/29199/454623-da-01-en-vs-kondensator-0805-29199615.pdf; ComponentLink6URL: https://datasheet.ciiva.com/139/partnumbering-e-01-139184.pdf; ComponentLink6Description: https://datasheet.ciiva.com/139/partnumbering-e-01-139184.pdf; ComponentLink7URL: https://datasheet.ciiva.com/139/partnumbering-e-01-139182.pdf; ComponentLink7Description: https://datasheet.ciiva.com/139/partnumbering-e-01-139182.pdf; ComponentLink8URL: https://datasheet.ciiva.com/139/partnumbering-e-01-139183.pdf; ComponentLink8Description: https://datasheet.ciiva.com/139/partnumbering-e-01-139183.pdf; ComponentLink9URL: https://datasheet.ciiva.com/7719/1747469-7719093.pdf; ComponentLink9Description: https://datasheet.ciiva.com/7719/1747469-7719093.pdf; ComponentLink10URL: https://datasheet.ciiva.com/28584/626718-28584279.pdf; ComponentLink10Description: https://datasheet.ciiva.com/28584/626718-28584279.pdf; ComponentLink11URL: https://datasheet.ciiva.com/14116/grmseries-highdielectrictype-eng-14116376.pdf; ComponentLink11Description: https://datasheet.ciiva.com/14116/grmseries-highdielectrictype-eng-14116376.pdf; Supplier Part Number 1: 490-5523-1-ND
U4 = NCP1117ST50T3G: IC REG LINEAR 5V 1A SOT223; Manufacturer 1: ON Semiconductor; Number of Outputs: 1; Max Input Voltage: 20V; Min Input Voltage: 3.5V; Dropout Voltage: 1.2V; Input Bias Current: 6mA; Polarity: Positive; Quiescent Current: 10mA; Output Voltage Accuracy: 1%; Power Rating: 781mW; Output Type: Fixed; Description: LDO Regulator Pos 5V 1A 4-Pin(3+Tab) SOT-223 T/R / IC REG LDO 5V 1A SOT223; Supplier 1: Digi-Key; Manufacturer Part Number 1: NCP1117ST50T3G; RoHS: Yes; Category: Voltage Regulators - Linear; Pricing 1: 4000=0.25323 (USD); Case/Package: SOT-223; Number of Pins: 4; Contact Plating: Tin,Matte; Min Operating Temperature: 0°C; Max Operating Temperature: 125°C; Package Quantity: 1; Output Voltage: 5V; Output Current: 1A; Max Output Current: 1A; Nominal Output Voltage: 5V; Packaging: Tape and Reel; Number of Regulators: 1; Min Current Limit: 1A; Accuracy: 1%; Tolerance: 1%; Length: 6.7mm; Width: 3.7mm; Height: 1.69mm; Radiation Hardening: No; REACH SVHC: No SVHC; Lead Free: Lead Free; Halogen Free: Halogen Free; RoHS Compliant: Yes; ComponentLink1URL: https://datasheet.ciiva.com/28483/1748260-28483320.pdf?src-supplier=Element14; ComponentLink1Description: https://datasheet.ciiva.com/28483/1748260-28483320.pdf?src-supplier=Element14; ComponentLink2URL: https://datasheet.ciiva.com/8073/ncp1117-d-8073902.pdf?src-supplier=Element14; ComponentLink2Description: https://datasheet.ciiva.com/8073/ncp1117-d-8073902.pdf?src-supplier=Element14; ComponentLink3URL: https://datasheet.ciiva.com/8073/ncp1117-d-8073736.pdf?src-supplier=Element14; ComponentLink3Description: https://datasheet.ciiva.com/8073/ncp1117-d-8073736.pdf?src-supplier=Element14; ComponentLink4URL: https://datasheet.ciiva.com/8231/ncp1117-d-8231068.pdf?src-supplier=Avnet; ComponentLink4Description: https://datasheet.ciiva.com/8231/ncp1117-d-8231068.pdf?src-supplier=Avnet; ComponentLink5URL: https://datasheet.ciiva.com/16209/ncp1117-d-16209561.pdf?src-supplier=Future+Electronics; ComponentLink5Description: https://datasheet.ciiva.com/16209/ncp1117-d-16209561.pdf?src-supplier=Future+Electronics; ComponentLink6URL: https://datasheet.ciiva.com/25978/ncp1117-d-25978293.pdf?src-supplier=Avnet+Europe; ComponentLink6Description: https://datasheet.ciiva.com/25978/ncp1117-d-25978293.pdf?src-supplier=Avnet+Europe; ComponentLink7URL: https://datasheet.ciiva.com/16491/ncp1117-d-16491895.pdf?src-supplier=Avnet+Asia; ComponentLink7Description: https://datasheet.ciiva.com/16491/ncp1117-d-16491895.pdf?src-supplier=Avnet+Asia; ComponentLink8URL: https://datasheet.ciiva.com/8233/ncp1117-d-8233593.pdf?src-supplier=Avnet; ComponentLink8Description: https://datasheet.ciiva.com/8233/ncp1117-d-8233593.pdf?src-supplier=Avnet; ComponentLink9URL: https://datasheet.ciiva.com/2042/ncp1117-d-2042019.pdf?src-supplier=Digi-Key; ComponentLink9Description: https://datasheet.ciiva.com/2042/ncp1117-d-2042019.pdf?src-supplier=Digi-Key; ComponentLink10URL: https://datasheet.ciiva.com/2042/ncp1117-d-2042020.pdf?src-supplier=Digi-Key; ComponentLink10Description: https://datasheet.ciiva.com/2042/ncp1117-d-2042020.pdf?src-supplier=Digi-Key; ComponentLink11URL: https://datasheet.ciiva.com/2042/ncp1117-d-2042018.pdf?src-supplier=Digi-Key; ComponentLink11Description: https://datasheet.ciiva.com/2042/ncp1117-d-2042018.pdf?src-supplier=Digi-Key; Supplier Part Number 1: NCP1117ST50T3GOSTR-ND
U5 = NCP1117ST33T3G: IC REG LINEAR 3.3V 1A SOT223; Manufacturer 1: ON Semiconductor; Max Input Voltage: 20V; Number of Outputs: 1; Dropout Voltage: 1.07V; Max Supply Voltage: 15V; Min Supply Voltage: 4.75V; Min Input Voltage: 3.5V; Input Bias Current: 6mA; Quiescent Current: 10mA; Polarity: Positive; Reference Voltage: 1.25V; Accuracy: 1%; Output Type: Fixed; Description: 1.0 A Positive LDO Linear Voltage Regulator (Fixed and Adjustable), V out : 3.3 V; Supplier 1: Digi-Key; Manufacturer Part Number 1: NCP1117ST33T3G; RoHS: Yes; Category: Voltage Regulators - Linear; Pricing 1: 1=0.67000, 10=0.57500, 25=0.53680, 100=0.42950, 250=0.39880, 500=0.33744, 1000=0.26075 (USD); Mount: Surface Mount; Case/Package: SOT-223; Number of Pins: 3; Contact Plating: Tin,Matte; Min Operating Temperature: 0°C; Max Operating Temperature: 125°C; Output Voltage: 3.3V; Packaging: Tape and Reel; Output Current: 1A; Max Output Current: 1A; Package Quantity: 1; Nominal Output Voltage: 3.3V; Number of Regulators: 1; Min Current Limit: 1A; Min Output Voltage: 3.3V; Max Output Voltage: 3.3V; Termination: SMD/SMT; Output Voltage Accuracy: 1%; Length: 6.7mm; Width: 3.7mm; Height: 1.69mm; Radiation Hardening: No; REACH SVHC: No SVHC; Lead Free: Lead Free; Halogen Free: Halogen Free; RoHS Compliant: Yes; ComponentLink1URL: https://datasheet.ciiva.com/22697/1726422-22697602.pdf?src-supplier=Element14; ComponentLink1Description: https://datasheet.ciiva.com/22697/1726422-22697602.pdf?src-supplier=Element14; ComponentLink2URL: https://datasheet.ciiva.com/3224/ncp1117-d-3224144.pdf?src-supplier=Avnet; ComponentLink2Description: https://datasheet.ciiva.com/3224/ncp1117-d-3224144.pdf?src-supplier=Avnet; ComponentLink3URL: https://datasheet.ciiva.com/15111/getdatasheetpartid-82718-15111483.pdf?src-supplier=Verical; ComponentLink3Description: https://datasheet.ciiva.com/15111/getdatasheetpartid-82718-15111483.pdf?src-supplier=Verical; ComponentLink4URL: https://datasheet.ciiva.com/8073/1726422-8073735.pdf?src-supplier=Element14; ComponentLink4Description: https://datasheet.ciiva.com/8073/1726422-8073735.pdf?src-supplier=Element14; ComponentLink5URL: https://datasheet.ciiva.com/28483/1748260-28483307.pdf?src-supplier=Element14; ComponentLink5Description: https://datasheet.ciiva.com/28483/1748260-28483307.pdf?src-supplier=Element14; ComponentLink6URL: https://datasheet.ciiva.com/16382/ncp1117-d-16382636.pdf?src-supplier=Future+Electronics; ComponentLink6Description: https://datasheet.ciiva.com/16382/ncp1117-d-16382636.pdf?src-supplier=Future+Electronics; ComponentLink7URL: https://datasheet.ciiva.com/8233/ncp1117-d-8233589.pdf?src-supplier=Avnet; ComponentLink7Description: https://datasheet.ciiva.com/8233/ncp1117-d-8233589.pdf?src-supplier=Avnet; ComponentLink8URL: https://datasheet.ciiva.com/2042/ncp1117-d-2042028.pdf?src-supplier=Digi-Key; ComponentLink8Description: https://datasheet.ciiva.com/2042/ncp1117-d-2042028.pdf?src-supplier=Digi-Key; ComponentLink9URL: https://datasheet.ciiva.com/2042/ncp1117-d-2042029.pdf?src-supplier=Digi-Key; ComponentLink9Description: https://datasheet.ciiva.com/2042/ncp1117-d-2042029.pdf?src-supplier=Digi-Key; Supplier Part Number 1: NCP1117ST33T3GOSCT-ND